# EAGLE schematic Domino Di No Teardrop (EAGLE 6.5.0)
Domino breakout Board
DATABASE: ./../Common/BOM/Domino_DB.txt; DRAWN: M.STEMPIN; REV: A
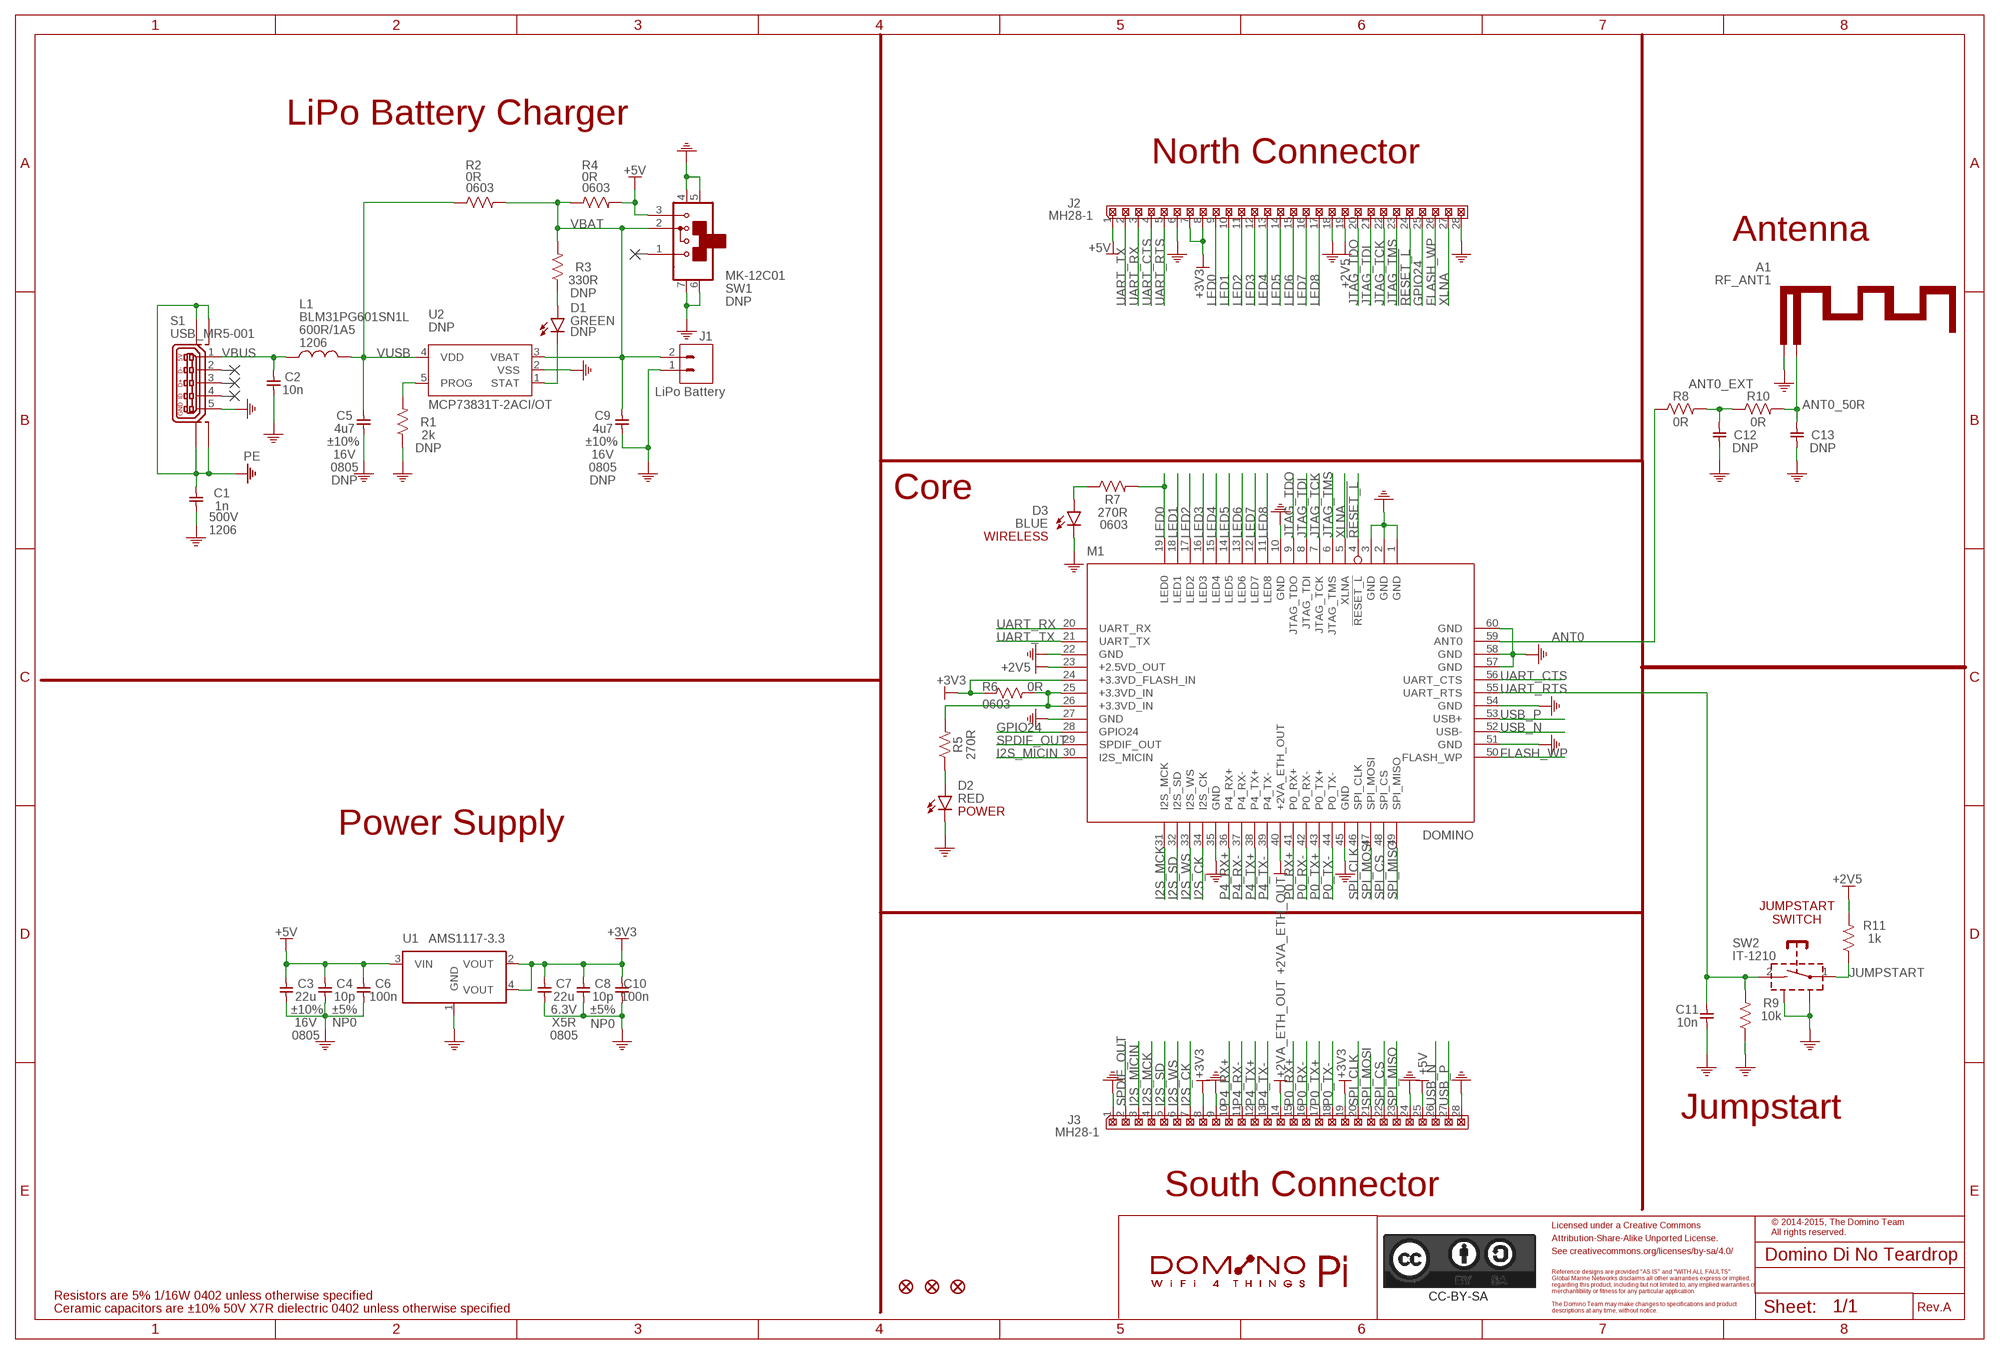
[diagram p0: schematic, sheet 1]
PORT1 (NC): BOM: EXCLUDE
PORT2 (NC): BOM: EXCLUDE
PORT3 (NC): BOM: EXCLUDE
PORT4 (NC): BOM: EXCLUDE

## Parts
A1  RF_ANT1  [RF_ANT1]
C1  1n  CAP_1206  [C1206]
C2  10n  CAP_0402  [C0402]
C3  22u  CAP_0805  [C0805]
C4  10p  CAP_0402  [C0402]
C5  4u7  CAP_0805  [C0805]
C6  100n  CAP_0402  [C0402]
C7  22u  CAP_0805  [C0805]
C8  10p  CAP_0402  [C0402]
C9  4u7  CAP_0805  [C0805]
C10  100n  CAP_0402  [C0402]
C11  10n  CAP_0402  [C0402]
C12  DNP  CAP_0402  [C0402]
C13  DNP  CAP_0402  [C0402]
CC-BY-SA  CC-BY-SA_LOGO  [CC-BY-SA_LOGO]
D1  GREEN  LED_0402  [LED0402]
D2  RED  LED_0402  [LED0402]
D3  BLUE  LED_0402  [LED0402]
F1  FIDUCIAL  [FIDUCIAL]
F2  FIDUCIAL  [FIDUCIAL]
F3  FIDUCIAL  [FIDUCIAL]
J1  LiPo Battery  S2B-PH-SM4-TB  [S2B-PH-SM4-TB]
J2  MH28-1  [MH28-1-0.1]
J3  MH28-1  [MH28-1-0.1]
L1  BLM31PG601SN1L  FB_1206  [FB1206]
M1  DOMINO  [DOMINO]
R1  2k  RES_0402  [R0402]
R2  0R  RES_0603  [R0603]
R3  330R  RES_0402  [R0402]
R4  0R  RES_0603  [R0603]
R5  270R  RES_0402  [R0402]
R6  0R  RES_0603  [R0603]
R7  270R  RES_0603  [R0603]
R8  0R  RES_0402  [R0402]
R9  10k  RES_0402  [R0402]
R10  0R  RES_0402  [R0402]
R11  1k  RES_0402  [R0402]
S1  USB_MR5-001  [USB-MR5-001]
SW1  MK-12C01  [MK-12C01]
SW2  IT-1210  [IT-1210]
U1  AMS1117-3.3  [SOT223]
U2  MCP73831T-2ACI/OT  [SOT23-5]
W1  DOMINO_PI_LOGO  [DOMINO_PI_LOGO]

## Nets
!RESET_L: J2.24 M1.4(!RESET_L)
+2V5: J2.19 M1.23(+2.5VD_OUT) R11.2
+2VA_ETH_OUT [Ethernet]: J3.14 M1.40(+2VA_ETH_OUT)
+3.3VD_IN: M1.25(+3.3VD_IN) M1.26(+3.3VD_IN) R5.2 R6.2
+3V3: C7.1 C8.1 C10.1 J2.7 J2.8 J3.8 J3.19 M1.24(+3.3VD_FLASH_IN) R6.1 U1.2(VOUT) U1.4(VOUT)
+5V: C3.1 C4.1 C6.1 J2.1 J3.25 R4.2 SW1.3 U1.3(VIN)
ANT0 [RF]: M1.59(ANT0) R8.1
ANT0_50R [RF]: A1.FEED C13.1 R10.2
ANT0_EXT [RF]: C12.1 R8.2 R10.1
BLUE_LED: D3.2(A) R7.1
FLASH_WP: J2.26 M1.50(FLASH_WP)
GND: A1.GND C1.2 C2.2 C3.2 C4.2 C5.2 C6.2 C7.2 C8.2 C9.2 C10.2 C11.2 C12.2 C13.2 D2.1(C) D3.1(C) J1.1 J2.6 J2.18 J2.28 J3.1 J3.9 J3.24 J3.28 M1.1(GND) M1.2(GND) M1.3(GND) M1.10(GND) M1.22(GND) M1.27(GND) M1.35(GND) M1.45(GND) M1.51(GND) M1.54(GND) M1.57(GND) M1.58(GND) M1.60(GND) R1.1 R9.1 S1.5 SW1.4 SW1.5 SW1.6 SW1.7 SW2.SH$1 SW2.SH$2 U1.1(GND) U2.2(VSS)
GPIO24: J2.25 M1.28(GPIO24)
I2S_CK: J3.7 M1.34(I2S_CK)
I2S_MCK: J3.4 M1.31(I2S_MCK)
I2S_MICIN: J3.3 M1.30(I2S_MICIN)
I2S_SD: J3.5 M1.32(I2S_SD)
I2S_WS: J3.6 M1.33(I2S_WS)
JTAG_TCK: J2.22 M1.7(JTAG_TCK)
JTAG_TDI: J2.21 M1.8(JTAG_TDI)
JTAG_TDO: J2.20 M1.9(JTAG_TDO)
JTAG_TMS: J2.23 M1.6(JTAG_TMS)
JUMPSTART: R11.1 SW2.1
LED0: J2.9 M1.19(LED0) R7.2
LED1: J2.10 M1.18(LED1)
LED2: J2.11 M1.17(LED2)
LED3: J2.12 M1.16(LED3)
LED4: J2.13 M1.15(LED4)
LED5: J2.14 M1.14(LED5)
LED6: J2.15 M1.13(LED6)
LED7: J2.16 M1.12(LED7)
LED8: J2.17 M1.11(LED8)
N$1: D2.2(A) R5.1
N$2: D1.1(C) U2.1(STAT)
N$3: D1.2(A) R3.1
N$5: R1.2 U2.5(PROG)
P0_RX+ [Ethernet]: J3.15 M1.41(P0_RX+)
P0_RX- [Ethernet]: J3.16 M1.42(P0_RX-)
P0_TX+ [Ethernet]: J3.17 M1.43(P0_TX+)
P0_TX- [Ethernet]: J3.18 M1.44(P0_TX-)
P4_RX+ [Ethernet]: J3.10 M1.36(P4_RX+)
P4_RX- [Ethernet]: J3.11 M1.37(P4_RX-)
P4_TX+ [Ethernet]: J3.12 M1.38(P4_TX+)
P4_TX- [Ethernet]: J3.13 M1.39(P4_TX-)
PE: C1.1 S1.SH$1(M0) S1.SH$2(M1) S1.SH$3(M2) S1.SH$4(M3)
SPDIF_OUT: J3.2 M1.29(SPDIF_OUT)
SPI_CLK: J3.20 M1.46(SPI_CLK)
SPI_CS: J3.22 M1.48(SPI_CS)
SPI_MISO: J3.23 M1.49(SPI_MISO)
SPI_MOSI: J3.21 M1.47(SPI_MOSI)
UART_CTS: J2.4 M1.56(UART_CTS)
UART_RTS: C11.1 J2.5 M1.55(UART_RTS) R9.2 SW2.2
UART_RX: J2.3 M1.20(UART_RX)
UART_TX: J2.2 M1.21(UART_TX)
USB_N [USB]: J3.26 M1.52(USB-)
USB_P [USB]: J3.27 M1.53(USB+)
VBAT: C9.1 J1.2 R2.2 R3.2 R4.1 SW1.2 U2.3(VBAT)
VBUS: C2.1 L1.2 S1.1
VUSB: C5.1 L1.1 R2.1 U2.4(VDD)
XLNA: J2.27 M1.5(XLNA)
Unconnected: S1.2 S1.3 S1.4 SW1.1

## Notes on the sheet
- LiPo Battery Charger
- North Connector
- Antenna
- Core
- WIRELESS
- POWER
- Power Supply
- JUMPSTART
  SWITCH
- Jumpstart
- South Connector
- Licensed under a Creative Commons
- © 2014-2015, The Domino Team
  All rights reserved.
- Attribution-Share-Alike Unported License.
- See creativecommons.org/licenses/by-sa/4.0/
- Reference designs are provided "AS IS" and "WITH ALL FAULTS".
- Global Marine Networks disclaims all other warranties express or implied,
- regarding this product, including but not limited to, any implied warranties of
- merchantibility or fitness for any particular application.
- Resistors are 5% 1/16W 0402 unless otherwise specified
- The Domino Team may make changes to specifications and product
- Ceramic capacitors are ±10% 50V X7R dielectric 0402 unless otherwise specified | descriptions at any time, without notice. | Rev.

## Library data of the parts
A1 = Domino:RF_ANT1: 2.4 GHz PCB WiFi Antenna; BOM: EXCLUDE; PARTNO: WIFI_ANT-2.4GHz
C1 = Domino:CAP_: Capacitor; PARTNO: C1206_1n_X7R_10%_CER_500V; SIZE: 1206; TC: X7R; TOL: ±10%; TYPE: CER; VOLT: 500V
C2 C11 = Domino:CAP_: Capacitor; PARTNO: C0402_10n_X7R_10%_CER_50V; SIZE: 0402; TC: X7R; TOL: ±10%; TYPE: CER; VOLT: 50V
C3 = Domino:CAP_: Capacitor; PARTNO: C0805_22u_X5R_20%_CER_6V3; SIZE: 0805; TC: X5R; TOL: ±10%; TYPE: CER; VOLT: 16V
C4 C8 = Domino:CAP_: Capacitor; PARTNO: C0402_10p_NP0_5%_CER_50V; SIZE: 0402; TC: NP0; TOL: ±5%; TYPE: CER; VOLT: 50V
C5 = Domino:CAP_: Capacitor; DNP: T; PARTNO: C0805_4u7_X5R_10%_CER_16V; SIZE: 0805; TC: X7R; TOL: ±10%; TYPE: CER; VOLT: 16V
C6 C10 = Domino:CAP_: Capacitor; PARTNO: C0402_100n_X7R_10%_CER_50V; SIZE: 0402; TC: X7R; TOL: ±10%; TYPE: CER; VOLT: 50V
C7 = Domino:CAP_: Capacitor; PARTNO: C0805_22u_X5R_20%_CER_6V3; SIZE: 0805; TC: X5R; TOL: ±20%; TYPE: CER; VOLT: 6.3V
C9 = Domino:CAP_: Capacitor; DNP: T; PARTNO: C0805_4u7_X5R_10%_CER_16V; SIZE: 0805; TC: X5R; TOL: ±10%; TYPE: CER; VOLT: 16V
C12 C13 = Domino:CAP_: Capacitor; DNP: T; PARTNO: C0402_DNP; SIZE: 0402
CC-BY-SA = Domino:CC-BY-SA_LOGO: Attribution-Share-Alike Unported License See creativecommons.org/licenses/by-sa/3.0/ for details.; BOM: EXCLUDE
D1 = Domino:LED_: LED; DNP: T; PARTNO: LED0402-GREEN
D2 = Domino:LED_: LED; PARTNO: LED0402-RED
D3 = Domino:LED_: LED; PARTNO: LED0402-BLUE
F1-F3 = Domino:FIDUCIAL: Fiducial Mark; BOM: EXCLUDE
J1 = Domino:S*B-PH-?-TB: JST PH Connector 2.0mm pithc/Disconnectable Crimp style connectors; PARTNO: S2B-PH-SM4-TB
J2 J3 = Domino:MH28-1: 28x1 Pin Male Header; PARTNO: MH28-1-0.1
L1 = Domino:FB_: Ferrite Bead; OPT: 600R/1A5; PARTNO: BLM31PG601SN1L; SIZE: 1206
M1 = Domino:DOMINO: GL-Connect Domino WiFi Module; PARTNO: DOMINO-CORE
R1 = Domino:RES_: Resistor; DNP: T; PARTNO: R0402_2k_5%_62.5mW; RATE: 62.5mW; SIZE: 0402; TOL: 5%
R2 R4 R6 = Domino:RES_: Resistor; PARTNO: R0603_0R_5%_125mW; RATE: 125mW; SIZE: 0603; TOL: 5%
R3 = Domino:RES_: Resistor; DNP: T; PARTNO: R0402_330R_5%_62.5mW; RATE: 62.5mW; SIZE: 0402; TOL: 5%
R5 = Domino:RES_: Resistor; PARTNO: R0402_270R_5%_62.5mW; RATE: 62.5mW; SIZE: 0402; TOL: 5%
R7 = Domino:RES_: Resistor; PARTNO: R0603_270R_5%_125mW; RATE: 125mW; SIZE: 0603; TOL: 5%
R8 R10 = Domino:RES_: Resistor; PARTNO: R0402_0R_5%_62.5mW; RATE: 62.5mW; SIZE: 0402; TOL: 5%
R9 = Domino:RES_: Resistor; PARTNO: R0402_10k_5%_62.5mW; RATE: 62.5mW; SIZE: 0402; TOL: 5%
R11 = Domino:RES_: Resistor; PARTNO: R0402_1k_5%_62.5mW; RATE: 62.5mW; SIZE: 0402; TOL: 5%
S1 = Domino:USB_MR5-001: Micro USB Type B Receptacle, 4 Shield Pins SMT; PARTNO: USB MR5-001
SW1 = Domino:MK-12C01: Slide Switch 1P2T 6V DC 0.3A; DNP: T; PARTNO: MK-12C01; RATE: 0.3A; VOLT: 6V
SW2 = Domino:IT-1210: Tact Switch SPST, 2 Contacts, 2 Shield Pins; PARTNO: IT-1210
U1 = Domino:AMS1117-: 1-A, Positive Fixed Voltage, Low-Dropout Regulator; PARTNO: AMS1117-3.3
U2 = Domino:MCP73831T-*/: Miniature Single-Cell, Fully Integrated Li-Ion, Li-Polymer Charge Management Controller; DNP: T; PARTNO: MCP73831T-2ACI/OT
W1 = Domino:DOMINO_PI_LOGO: Domino Pi Logo; BOM: EXCLUDE

## Net classes
1 USB: width 0.368 mm, clearance 0.152 mm to class 0, clearance 0.152 mm
2 RF: width 0.66 mm, clearance 0.152 mm
3 Ethernet: width 0.254 mm, clearance 0.152 mm to class 0, clearance 0.152 mm to class 1, clearance 0.152 mm to class 2, clearance 0.152 mm